# EAGLE design oled-lpc81x (EAGLE 6.4)
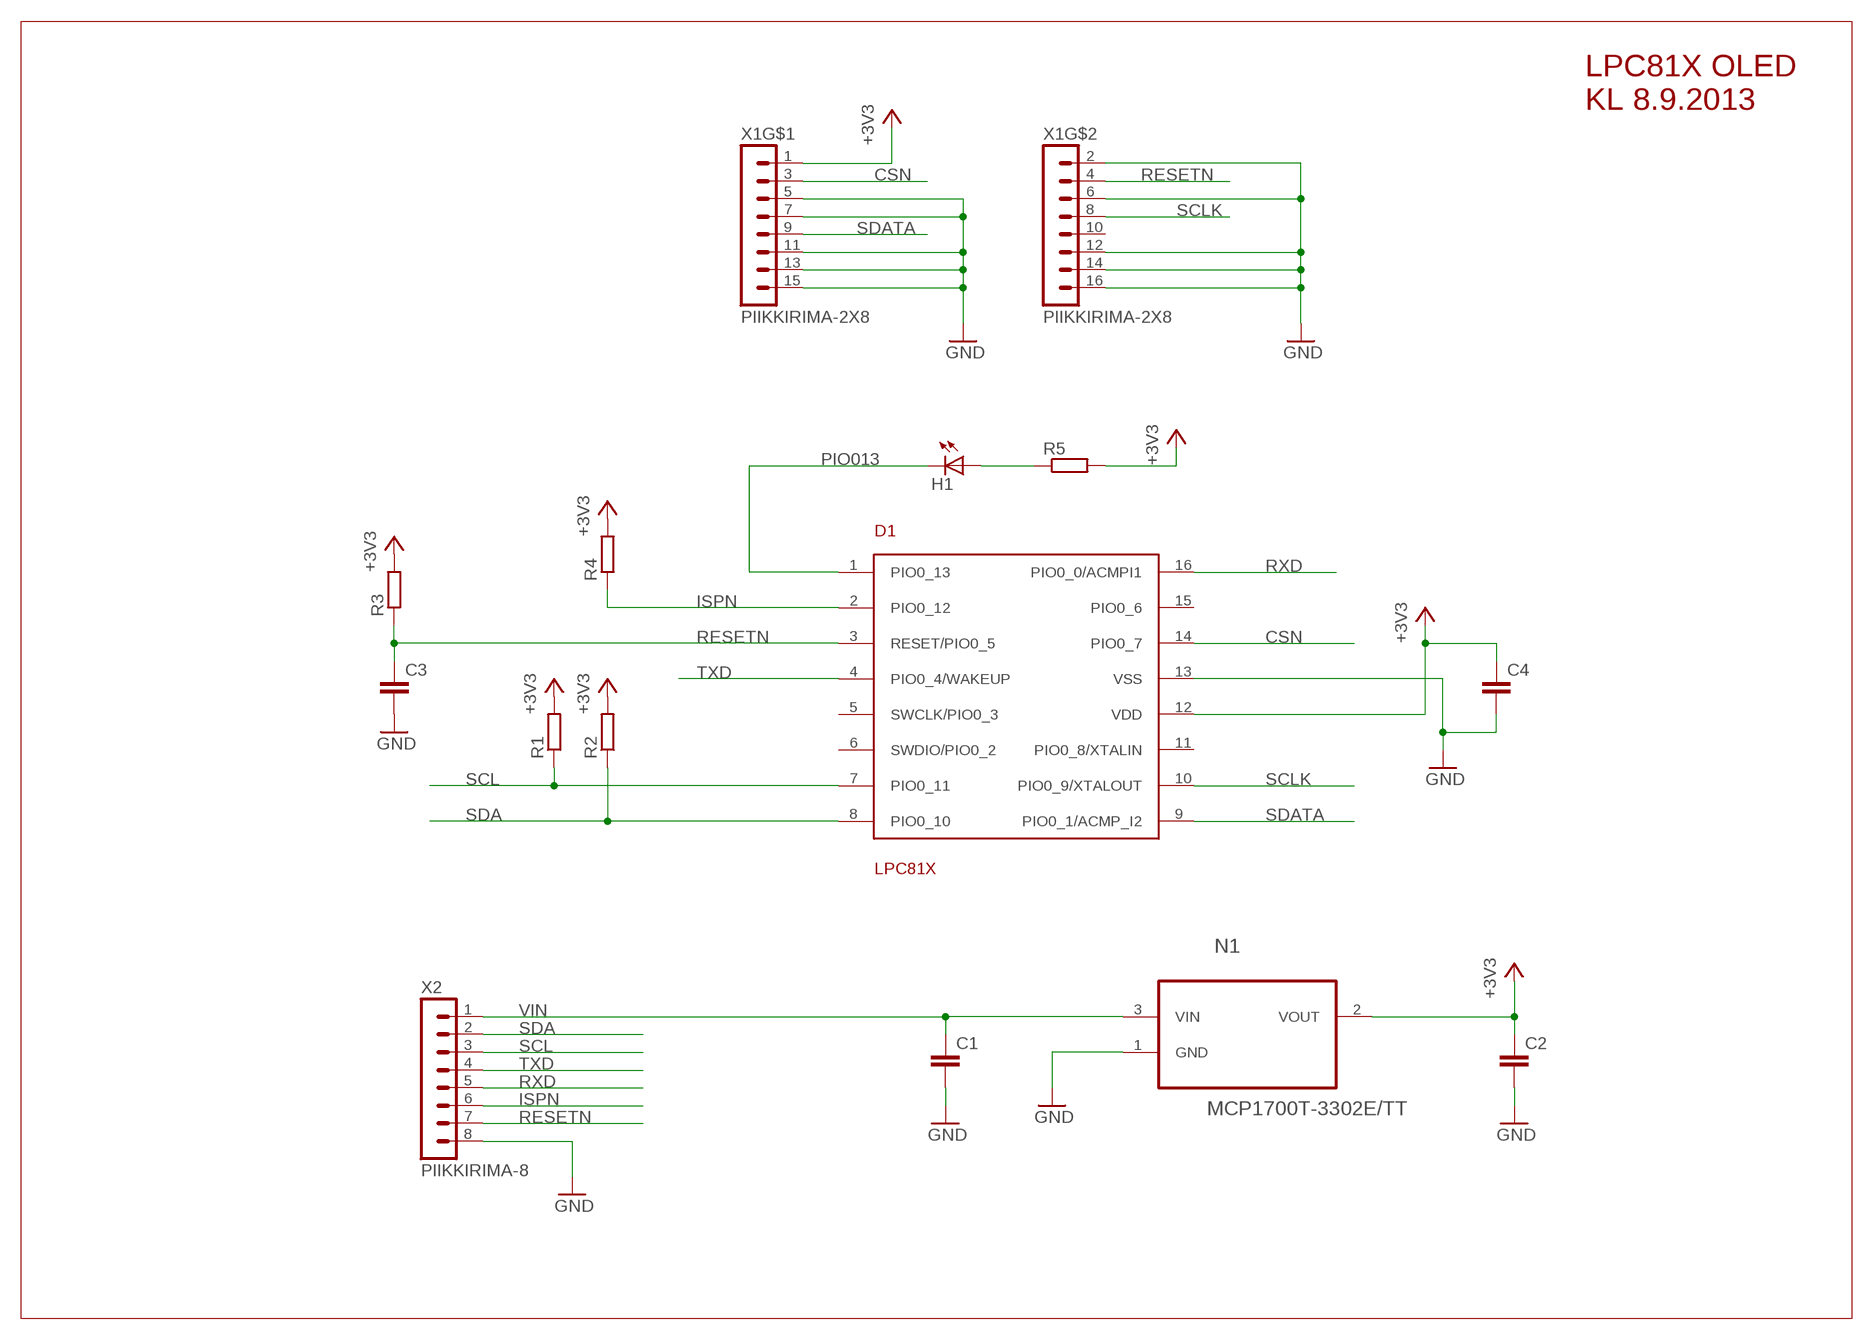
[diagram p0: schematic, sheet 1]

## Parts
C1  C-EUC0805  [C0805]
C2  C-EUC0805  [C0805]
C3  C-EUC0603  [C0603]
C4  C-EUC0805  [C0805]
D1  LPC81X  [TSSOP16]
H1  LEDCHIP-LED0603  [CHIP-LED0603]
N1  MCP1700T-3302E/TT  [SOT95P237X112-3N]
R1  R-EU_R0603  [R0603]
R2  R-EU_R0603  [R0603]
R3  R-EU_R0603  [R0603]
R4  R-EU_R0603  [R0603]
R5  R-EU_R0603  [R0603]
X1  PIIKKIRIMA-2X8  [PIIKKIRIMA-2X8]
X2  PIIKKIRIMA-8  [PIIKKIRIMA-8]

## Nets
+3V3: C2.1 C4.1 D1.12(VDD) N1.2(VOUT) R1.2 R2.2 R3.2 R4.2 R5.2 X1.1
CSN: D1.14(PIO0_7) X1.3
GND: C1.2 C2.2 C3.2 C4.2 D1.13(VSS) N1.1(GND) X1.2 X1.5 X1.6 X1.7 X1.11 X1.12 X1.13 X1.14 X1.15 X1.16 X2.8
ISPN: D1.2(PIO0_12) R4.1 X2.6
N$2: H1.A R5.1
PIO013: D1.1(PIO0_13) H1.C
RESETN: C3.1 D1.3(RESET/PIO0_5) R3.1 X1.4 X2.7
RXD: D1.16(PIO0_0/ACMPI1) X2.5
SCL: D1.7(PIO0_11) R1.1 X2.3
SCLK: D1.10(PIO0_9/XTALOUT) X1.8
SDA: D1.8(PIO0_10) R2.1 X2.2
SDATA: D1.9(PIO0_1/ACMP_I2) X1.9
TXD: D1.4(PIO0_4/WAKEUP) X2.4
VIN: C1.1 N1.3(VIN) X2.1
Unconnected: D1.5(SWCLK/PIO0_3) D1.6(SWDIO/PIO0_2) D1.11(PIO0_8/XTALIN) D1.15(PIO0_6) X1.10

## Notes on the sheet
- LPC81X OLED
  KL 8.9.2013

## Library data of the parts
C1-C4 = rcl:C-EU: CAPACITOR, European symbol
D1 = seb:LPC81X
H1 = OMAT_IC:LED: LED OSRAM: - CHIPLED LG R971, LG N971, LY N971, LG Q971, LY Q971, LO R971, LY R971 LH N974, LH R974 LS Q976, LO Q976, LY Q976 LO Q996 - Hyper CHIPLED LW Q18S LB Q993, LB Q99A, LB R99A - SideLED LS A670, LO A670, LY A670, LG A670, LP A670 LB A673, LV A673, LT A673, LW A673 LH A674 LY A675 LS A676, LA A676, LO A676, LY A676, LW A676 LS A679, LY A679, LG A679 - Hyper Micro SIDELED® LS Y876, LA Y876, LO Y876, LY Y876 LT Y87S - SmartLED LW L88C, LW L88S LB L89C, LB L89S, LG L890 LS L89K, LO L89K, LY L89K LS L896, LA L896, LO L896, LY L896 - TOPLED LS T670, LO T670, LY T670, LG T670, LP T670 LSG T670, LSP T670, LSY T670, LOP T670, LYG T670 LG T671, LOG T671, LSG T671 LB T673, LV T673, LT T673, LW T673 LH T674 LS T676, LA T676, LO T676, LY T676, LB T676, LH T676, LSB T676, LW T676 LB T67C, LV T67C, LT T67C, LS T67K, LO T67K, LY T67K, LW E67C LS E67B, LA E67B, LO E67B, LY E67B, LB E67C, LV E67C, LT E67C LW T67C LS T679, LY T679, LG T679 LS T770, LO T770, LY T770, LG T770, LP T770 LB T773, LV T773, LT T773, LW T773 LH T774 LS E675, LA E675, LY E675, LS T675 LS T776, LA T776, LO T776, LY T776, LB T776 LHGB T686 LT T68C, LB T68C - Hyper Mini TOPLED® LB M676 - Mini TOPLED Santana® LG M470 LS M47K, LO M47K, LY M47K Source: http://www.osram.convergy.de LUXEON: - LUMILED® LXK2-PW12-R00, LXK2-PW12-S00, LXK2-PW14-U00, LXK2-PW14-V00 LXK2-PM12-R00, LXK2-PM12-S00, LXK2-PM14-U00 LXK2-PE12-Q00, LXK2-PE12-R00, LXK2-PE12-S00, LXK2-PE14-T00, LXK2-PE14-U00 LXK2-PB12-K00, LXK2-PB12-L00, LXK2-PB12-M00, LXK2-PB14-N00, LXK2-PB14-P00, LXK2-PB14-Q00 LXK2-PR12-L00, LXK2-PR12-M00, LXK2-PR14-Q00, LXK2-PR14-R00 LXK2-PD12-Q00, LXK2-PD12-R00, LXK2-PD12-S00 LXK2-PH12-R00, LXK2-PH12-S00 LXK2-PL12-P00, LXK2-PL12-Q00, LXK2-PL12-R00 Source: www.luxeon.com KINGBRIGHT: KA-3528ASYC Source: www.kingbright.com
N1 = Microchip_By_element14_Batch_1:MCP1700T-3302E/TT: Low Quiescent Current LDO; MPN: MCP1700T-3302E/TT; OC_FARNELL: 1296592; OC_NEWARK: 88H9817; PACKAGE: SOT23-3; SUPPLIER: Microchip
R1-R5 = rcl:R-EU_: RESISTOR, European symbol
X1 = OMAT_IC:PIIKKIRIMA-2X8
X2 = OMAT_IC:PIIKKIRIMA-8

## Board
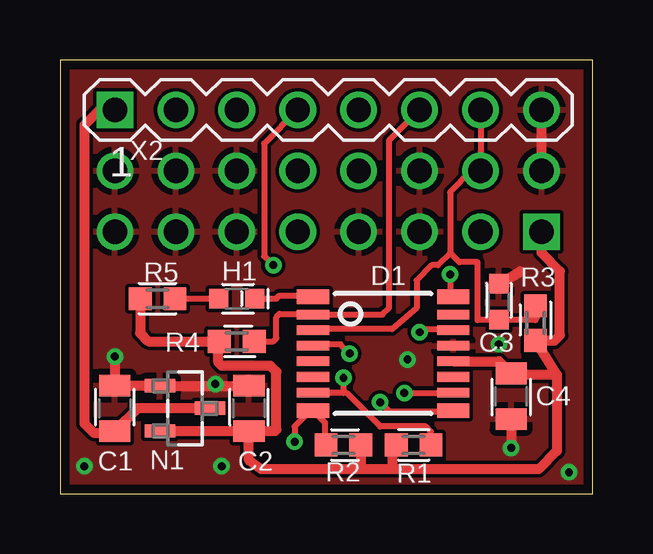
[diagram p1: board, top side]
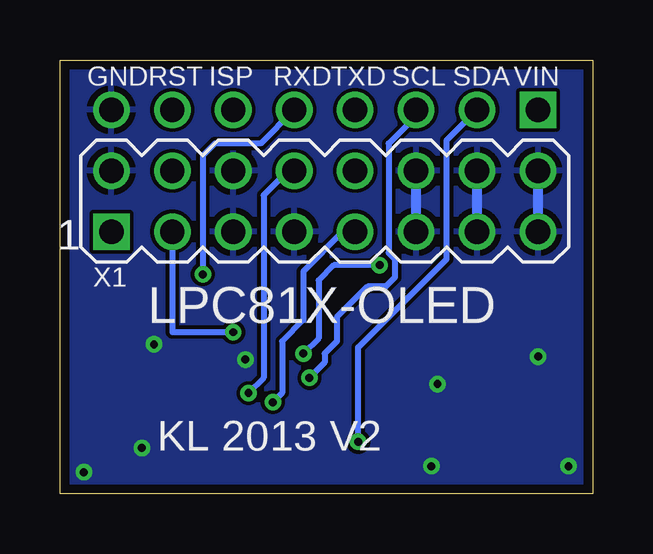
[diagram p2: board, bottom side, seen from below]

Size 22.21 x 18.09 mm. Coordinates in mm from the lower left corner, seen from the top.
Outline: 0,0 22.21,0 22.21,18.09 0,18.09 0,0
Copper layers (1*16): Top 0.0356mm / dielectric 1.5011mm / Bottom 0.0356mm
Design rules "LaenPCBOrder": minimum track width 6mil, minimum drill 13mil, track to track 6mil, track to pad 6mil, pad to pad 6mil, via to via 6mil, smd to smd 6mil, copper to edge 15mil, drill to drill 6mil, minimum pad ring 7mil, minimum via ring 7mil, stop-mask expansion 4mil, vias tented up to drill 0mil, thermal gap 10mil

### Footprints (pad centres in the part's own frame; a part is rotated, then mirrored left to right if it is on the bottom)
C0805 = smd 0.9 x 1.3: 1 -0.95,0; 2 0.95,0
C0603 = smd 0.8 x 0.8: 1 -0.75,0; 2 0.75,0
TSSOP16 = smd 0.6 x 1.35: 1 -2.375,-2.925; 8 2.375,-2.925; 9 2.375,2.925; 16 -2.375,2.925 | smd 0.4 x 1.35: 2 -1.625,-2.925; 3 -0.975,-2.925; 4 -0.325,-2.925; 5 0.325,-2.925; 6 0.975,-2.925; 7 1.625,-2.925; 10 1.625,2.925; 11 0.975,2.925; 12 0.325,2.925; 13 -0.325,2.925; 14 -0.975,2.925; 15 -1.625,2.925
CHIP-LED0603 = smd 0.8 x 0.8: A -0.75,0; C 0.75,0
SOT95P237X112-3N = smd 0.559 x 1.27: 1 -0.94,-1.041; 2 0.94,-1.041; 3 0,1.041
R0603 = smd 0.95 x 0.95: 1 -0.725,0; 2 0.725,0
PIIKKIRIMA-2X8 = drill 1.016 square: 1 0,0 | drill 1.016: 2 0,2.54; 3 2.54,0; 4 2.54,2.54; 5 5.08,0; 6 5.08,2.54; 7 7.62,0; 8 7.62,2.54; 9 10.16,0; 10 10.16,2.54; 11 12.7,0; 12 12.7,2.54; 13 15.24,0; 14 15.24,2.54; 15 17.78,0; 16 17.78,2.54
PIIKKIRIMA-8 = drill 1.016 square: 1 0,0 | drill 1.016: 2 2.54,0; 3 5.08,0; 4 7.62,0; 5 10.16,0; 6 12.7,0; 7 15.24,0; 8 17.78,0

### Placement (x,y rotation side)
C1  2.29,3.56 90 top
C2  7.87,3.56 90 top
C3  18.29,8 90 top
C4  18.8,4.06 270 top
D1  13.46,5.84 270 top
H1  7.37,8.13 0 top
N1  5.21,3.56 270 top
R1  14.73,2.03 180 top
R2  11.81,2.03 0 top
R3  19.81,7.11 270 top
R4  7.37,6.35 180 top
R5  4.06,8.13 180 top
X1  20.07,10.92 0 bottom
X2  2.29,16 0 top

### Tracks (layer width: path | path; a pad name or v marks a point on that pad's centre or on a via)
+3V3
  Top 0.406: 20.7,4.95 20.7,1.78 19.94,1.02 13.84,1.02 | 13.84,1.02 12.57,1.02 | 12.57,1.02 8.38,1.02 7.87,1.4 C2.1 | R2.2 12.54,1.18 12.57,1.02 | R1.2 13.84,2.03 13.84,1.02 | C2.1 7.81,2.61 7.75,2.54 | N1.2 7.86,2.62 C2.1 | R5.2 3.34,6.69 3.68,6.35 R4.2 6.6,6.31 6.6,5.46 6.73,5.33 8.76,5.33 9.02,5.08 9.02,2.67 8.96,2.61 C2.1 | 20.7,4.95 R3.2 20.61,6.39 20.83,6.6 20.83,9.27 20.07,10.03 X1.1 | 20.7,4.95 18.86,4.95 C4.1 18.29,5.52 D1.12
CSN  (via drill 0.33)
  Top 0.254: v14.99,6.73 14.99,6.6 15.24,6.86 16.35,6.86 D1.14
  Bottom 0.254: X1.3 17.53,6.73 v14.99,6.73
GND  (via drill 0.33)
  Top 0.406: 7.78,4.6 C2.2 7.86,4.5 N1.1 C1.2 | C1.2 | 18.74,3.18 C4.2 v18.8,1.9 | C1.2 v2.3,5.7 v2.29,5.71 | C3.2 19.18,9.27 | X1.2 X2.8
  Bottom 0.406: X1.15 X1.16 | X1.13 X1.14 | X1.11 X1.12
  other vias: 1.02,1.14 14.48,5.59 21.21,0.89 6.73,1.14 6.48,4.57 18.29,6.22
  pour Top: 0.13,18.03 22.35,18.03 22.35,0 0.13,0
  pour Bottom: 0.13,18.03 22.23,18.03 22.23,0 0.13,0
ISPN
  Top 0.254: R4.1 8.89,6.35 9.02,6.48 9.02,7.37 9.14,7.49 10.51,7.49 D1.2 13.44,7.47 13.72,7.75 13.72,14.73 X2.6
N$2
  Top 0.254: R5.1 H1.A
PIO013
  Top 0.254: H1.C 9.02,8.13 9.14,8.25 10.5,8.25 D1.1
RESETN
  Top 0.254: X2.7 X1.4 17.14,13.46 16.26,12.57 16.26,10.03 | 16.26,10.03 15.75,9.52 15.49,9.52 14.86,8.89 14.86,7.75 13.84,6.86 10.58,6.86 D1.3 | R3.1 20.16,7.84 19.94,7.62 19.94,7.49 19.81,7.24 19.19,7.24 C3.1 17.4,7.24 17.4,9.65 16.64,9.65 16.26,10.03
RXD  (via drill 0.33)
  Top 0.254: v16.26,9.14 16.26,8.35 D1.16
  Bottom 0.254: X2.5 13.84,14.61 15.75,14.61 16.26,14.1 v16.26,9.14
SCL  (via drill 0.33)
  Top 0.254: R1.1 15.46,2.58 15.24,2.79 13.34,2.79 11.94,4.19 11.81,4.19 | 11.81,4.19 10.56,4.19 D1.7 | v11.81,4.83 11.81,4.19
  Bottom 0.254: X2.3 7.37,15.75 8.51,14.61 8.51,10.03 8.26,9.78 8.26,9.02 8.64,8.64 9.4,8.64 10.67,7.37 10.67,6.35 11.18,5.84 11.18,5.46 v11.81,4.83
SCLK  (via drill 0.33)
  Top 0.254: v14.35,4.19 16.36,4.19 D1.10
  Bottom 0.254: X1.8 12.7,13.46 13.72,12.45 13.72,4.83 v14.35,4.19
SDA  (via drill 0.33)
  Top 0.254: R2.1 11.09,2.25 11.05,2.29 11.05,2.95 D1.8 10.45,3.47 9.78,2.79 v9.78,2.16
  Bottom 0.254: v9.78,2.16 9.78,6.1 6.1,9.78 6.1,14.73 X2.2
SDATA  (via drill 0.33)
  Top 0.254: v13.34,3.81 13.72,3.43 16.35,3.43 D1.9
  Bottom 0.254: X1.9 10.41,10.92 12.07,9.27 12.07,7.24 12.95,6.35 12.95,4.19 v13.34,3.81
TXD  (via drill 0.33)
  Top 0.254: X2.4 8.51,14.61 8.51,9.91 v8.89,9.52 | v12.07,5.84 11.68,6.22 10.59,6.22 D1.4
  Bottom 0.254: v8.89,9.52 10.8,9.52 11.43,8.89 11.43,6.48 v12.07,5.84
VIN
  Top 0.406: N1.3 3.24,3.56 C1.1 2.22,2.54 1.4,2.54 1.02,2.92 1.02,15.37 1.65,16 X2.1

### Text on the board
bPlace: VIN | SDA | SCL | TXD | RXD | ISP | RST | GND | LPC81X-OLED | KL 2013 V2